# EAGLE design servotester (EAGLE 7.5.0)
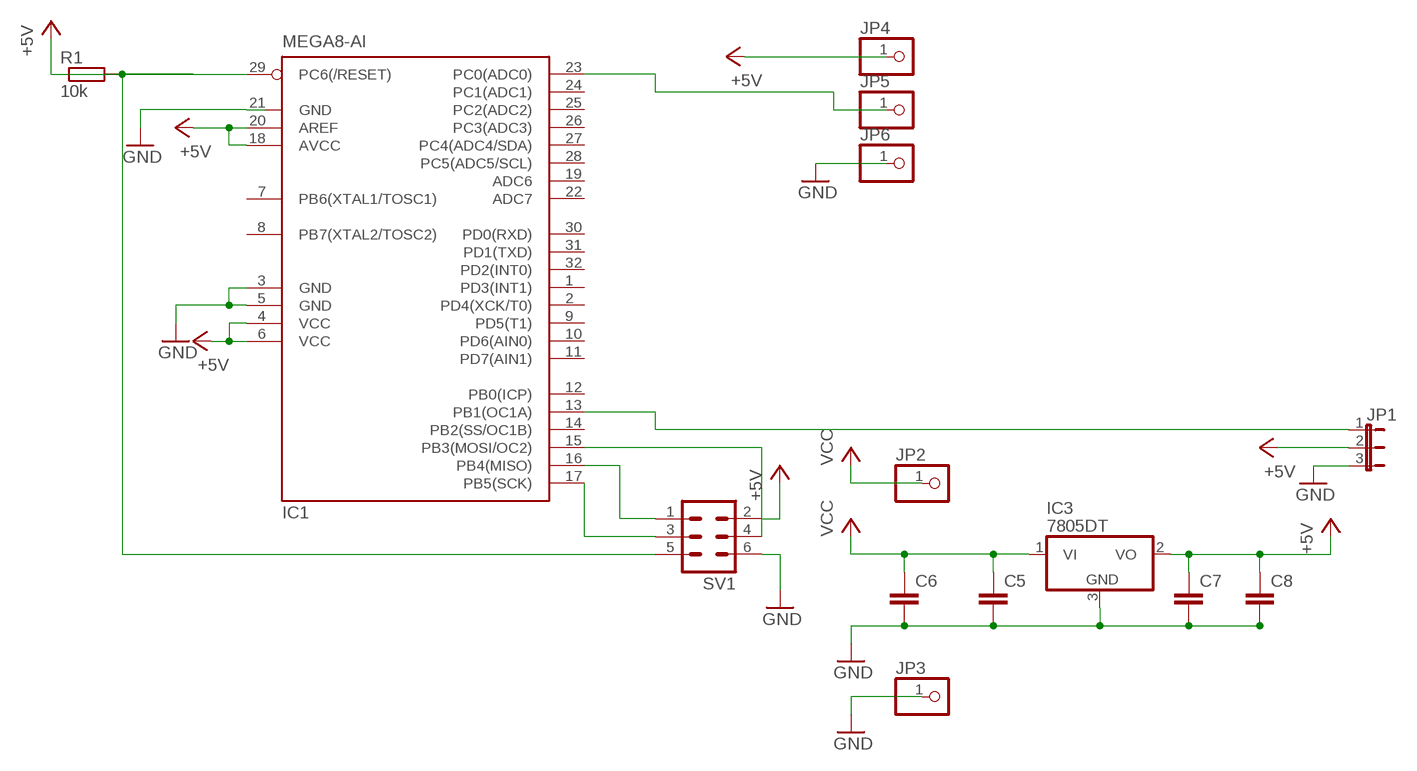
[diagram p0: schematic, sheet 1]

## Parts
C5  C-EUC1608  [C1608]
C6  C-EUC3216  [C3216]
C7  C-EUC1608  [C1608]
C8  C-EUC3216  [C3216]
IC1  MEGA8-AI  [TQFP32-08]
IC3  7805DT  [TO252]
JP1  JP2E  [JP2]
JP2  PINHD-1X1  [1X01]
JP3  PINHD-1X1  [1X01]
JP4  PINHD-1X1  [1X01]
JP5  PINHD-1X1  [1X01]
JP6  PINHD-1X1  [1X01]
R1  10k  R-EU_R0603  [R0603]
SV1  MA03-2  [MA03-2]

## Nets
+5V: C7.1 C8.1 IC1.4(VCC) IC1.6(VCC) IC1.18(AVCC) IC1.20(AREF) IC3.2(VO) JP1.2 JP4.1 R1.1 SV1.2
GND: C5.2 C6.2 C7.2 C8.2 IC1.3(GND) IC1.5(GND) IC1.21(GND) IC3.3(GND) JP1.3 JP3.1 JP6.1 SV1.6
N$1: IC1.29(PC6(/RESET)) R1.2 SV1.5
N$2: IC1.23(PC0(ADC0)) JP5.1
N$4: IC1.13(PB1(OC1A)) JP1.1
N$5: IC1.16(PB4(MISO)) SV1.1
N$6: IC1.17(PB5(SCK)) SV1.3
N$7: IC1.15(PB3(MOSI/OC2)) SV1.4
VCC: C5.1 C6.1 IC3.1(VI) JP2.1
Unconnected: IC1.1(PD3(INT1)) IC1.2(PD4(XCK/T0)) IC1.7(PB6(XTAL1/TOSC1)) IC1.8(PB7(XTAL2/TOSC2)) IC1.9(PD5(T1)) IC1.10(PD6(AIN0)) IC1.11(PD7(AIN1)) IC1.12(PB0(ICP)) IC1.14(PB2(SS/OC1B)) IC1.19(ADC6) IC1.22(ADC7) IC1.24(PC1(ADC1)) IC1.25(PC2(ADC2)) IC1.26(PC3(ADC3)) IC1.27(PC4(ADC4/SDA)) IC1.28(PC5(ADC5/SCL)) IC1.30(PD0(RXD)) IC1.31(PD1(TXD)) IC1.32(PD2(INT0))

## Library data of the parts
C5-C8 = resistor:C-EU: CAPACITOR, European symbol
IC1 = atmel:MEGA8: MICROCONTROLLER 8 Kbytes FLASH, 1 kbytes SRAM, 512 bytes EEPROM, USART, 6-channel 10 bit ADC, 2-channel 8 bit ADC Pin compatible with Atmega48, ATMega88, ATMega168 Source: avr.lbr; MPN: ATMEGA8-16AU; OC_FARNELL: 9171371; OC_NEWARK: 73M8863
IC3 = linear:78*: Positive VOLTAGE REGULATOR Source: http://cache.national.com/ds/LM/LM78L05.pdf http://www.fairchildsemi.com/ds/LM/LM7805.pdf
JP1 = jumper:JP2E: JUMPER
JP2-JP6 = pinhead:PINHD-1X1: PIN HEADER
R1 = resistor:R-EU_: RESISTOR, European symbol
SV1 = con-lstb:MA03-2: PIN HEADER; OC_FARNELL: unknown; OC_NEWARK: unknown

## Board
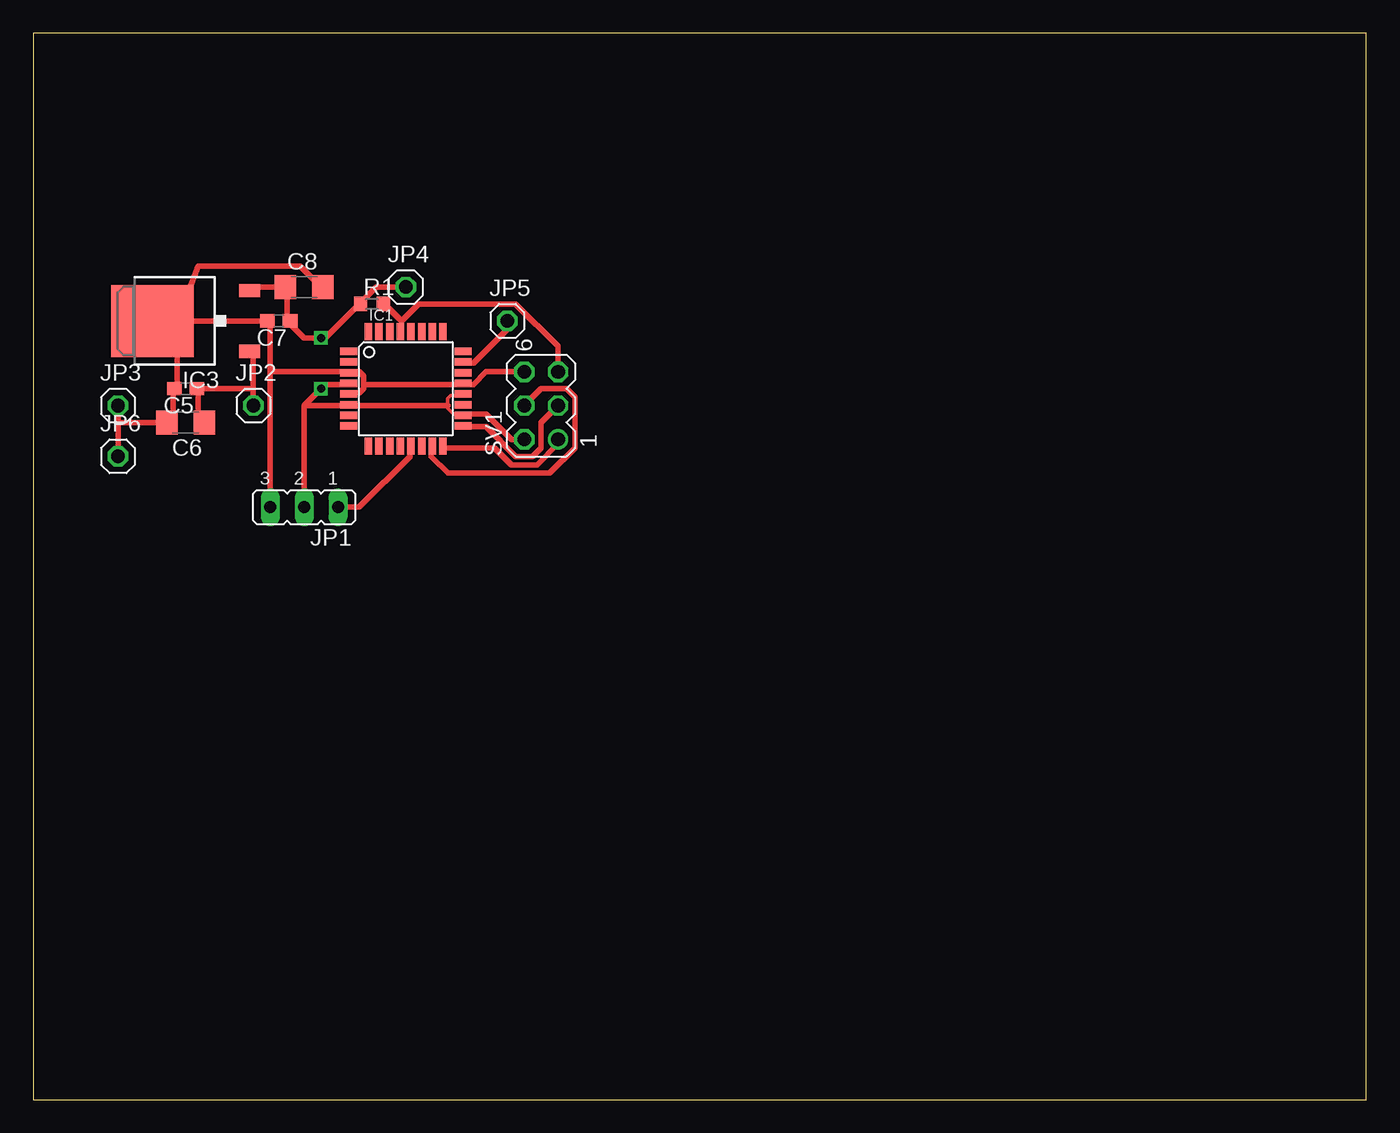
[diagram p1: board, top side]
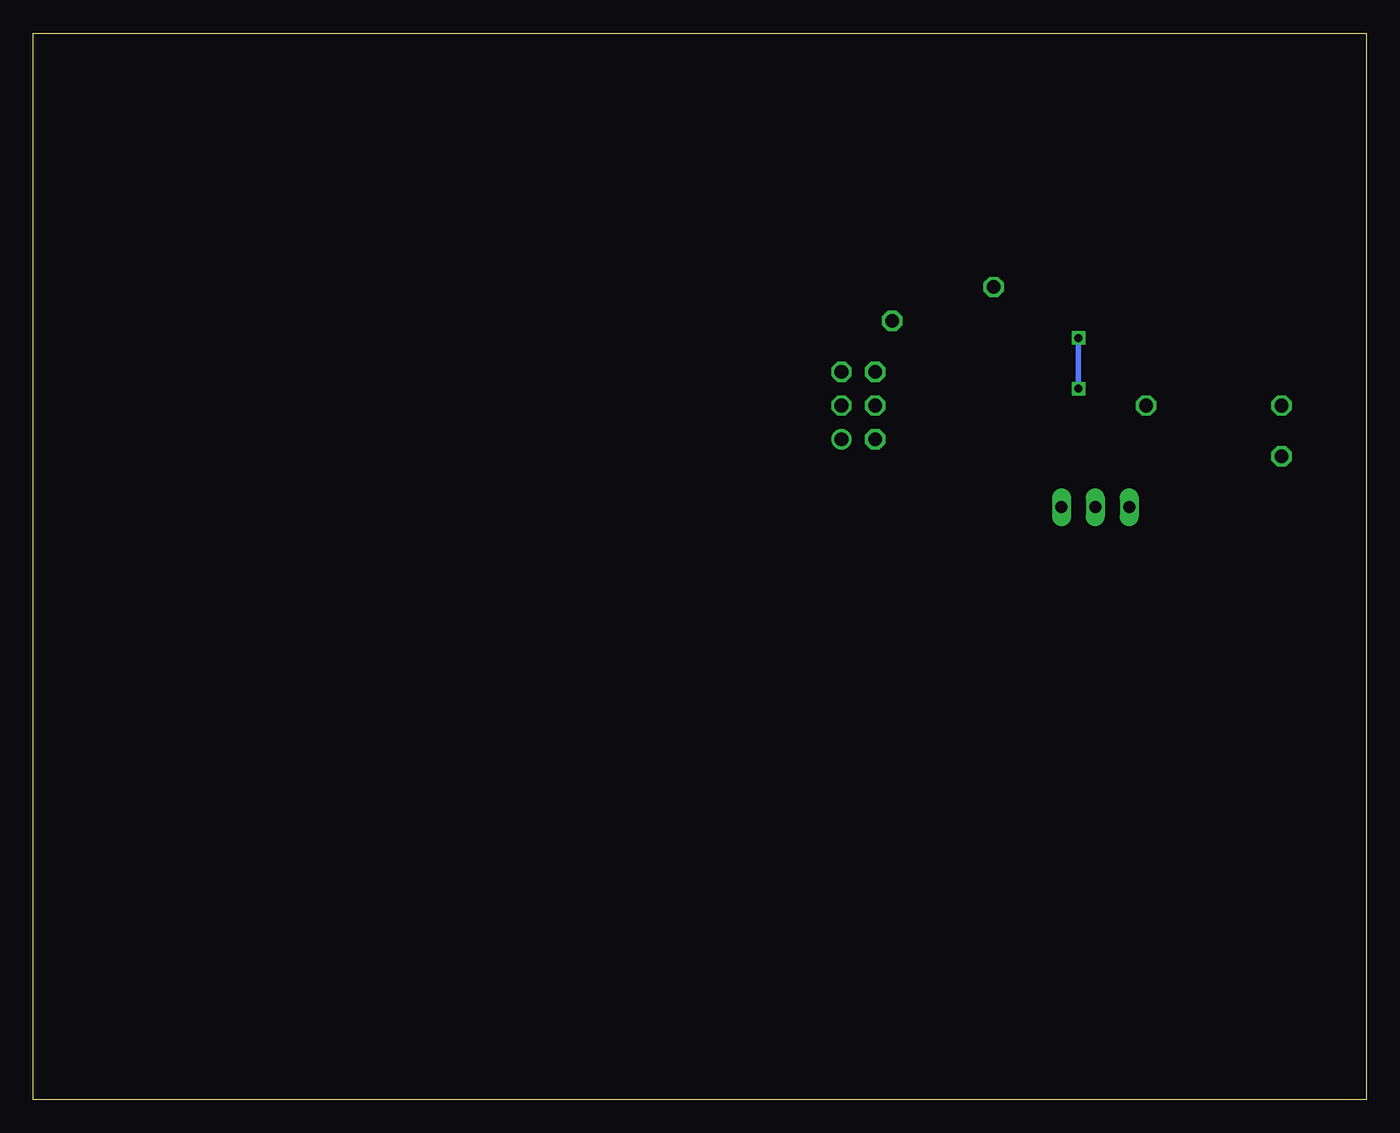
[diagram p2: board, bottom side, seen from below]

Size 100 x 80 mm. Coordinates in mm from the lower left corner, seen from the top.
Outline: 0,0 100,0 100,80 0,80 0,0
Copper layers (1*16): Top 0.035mm / dielectric 1.5mm / Bottom 0.035mm
Design rules "default *": minimum track width 0.4mm, minimum drill 1mm, track to track 0.2mm, track to pad 0.2mm, pad to pad 1mm, via to via 1mm, smd to smd 8mil, copper to edge 40mil, drill to drill 8mil, minimum pad ring 10mil, minimum via ring 8mil, stop-mask expansion 4mil, vias tented up to drill 0mil, thermal gap 10mil

### Footprints (pad centres in the part's own frame; a part is rotated, then mirrored left to right if it is on the bottom)
C1608 = smd 1.1 x 1: 1 -0.85,0; 2 0.85,0
C3216 = smd 1.6 x 1.8: 1 -1.4,0; 2 1.4,0
TQFP32-08 = smd 1.27 x 0.559: 1 -4.293,2.8; 2 -4.293,2; 3 -4.293,1.2; 4 -4.293,0.4; 5 -4.293,-0.4; 6 -4.293,-1.2; 7 -4.293,-2; 8 -4.293,-2.8; 17 4.293,-2.8; 18 4.293,-2; 19 4.293,-1.2; 20 4.293,-0.4; 21 4.293,0.4; 22 4.293,1.2; 23 4.293,2; 24 4.293,2.8 | smd 0.559 x 1.27: 9 -2.8,-4.293; 10 -2,-4.293; 11 -1.2,-4.293; 12 -0.4,-4.293; 13 0.4,-4.293; 14 1.2,-4.293; 15 2,-4.293; 16 2.8,-4.293; 25 2.8,4.293; 26 2,4.293; 27 1.2,4.293; 28 0.4,4.293; 29 -0.4,4.293; 30 -1.2,4.293; 31 -2,4.293; 32 -2.8,4.293
TO252 = smd 1 x 1.6: 1 -2.28,-4.8; 2 2.28,-4.8 | smd 5.4 x 6.2: 3 0,2.5
JP2 = drill 0.914 long: 1 -2.54,0; 2 0,0; 3 2.54,0
1X01 = drill 1.016 octagon: 1 0,0
R0603 = smd 1 x 1.1: 1 -0.85,0; 2 0.85,0
MA03-2 = drill 1.016: 1 -2.54,-1.27 | drill 1.016 octagon: 2 -2.54,1.27; 3 0,-1.27; 4 0,1.27; 5 2.54,-1.27; 6 2.54,1.27

### Placement (x,y rotation side)
C5  11.43,53.34 180 top
C6  11.43,50.8 180 top
C7  18.41,58.42 180 top
C8  20.32,60.96 0 top
IC1  27.94,53.34 0 top
IC3  11.43,58.42 90 top
JP1  20.32,44.45 180 top
JP2  16.51,52.07 0 top
JP3  6.35,52.07 0 top
JP4  27.94,60.96 0 top
JP5  35.56,58.42 0 top
JP6  6.35,48.26 0 top
R1  25.4,59.69 0 top
SV1  38.1,52.07 90 top

### Tracks (layer width: path | path; a pad name or v marks a point on that pad's centre or on a via)
+5V  (via drill 0.6)
  Top 0.254: 16.19,60.96 IC3.2 | IC1.18 32.23,51.44 31.55,51.44 31.09,51.89 31.09,52.07 31.09,52.58 31.32,52.81 32.23,52.81 IC1.20 | 23.77,52.12 IC1.6
  Top 0.4: C7.1 19.05,58.42 19.05,60.96 C8.1 16.51,60.96 IC3.2 | 24.45,59.69 21.91,57.15 v21.59,57.15 | 20.32,52.07 23.5,52.07 IC1.6 23.81,52.07 31.09,52.07 31.11,52.07 | v21.59,53.34 21.91,53.66 23.5,53.66 IC1.4 | SV1.2 35.88,49.53 33.97,51.44 32.38,51.44 IC1.18 | JP4.1 25.72,60.96 24.45,59.69 | 24.45,59.69 R1.1
  Top 0.406: JP1.2 20.32,52.07 v21.59,53.34 | v21.59,57.15 20.32,57.15 19.05,58.42
  Bottom 0.406: v21.59,53.34 v21.59,57.15
GND
  Top 0.254: 24.46,53.03 24.45,53.03 23.77,53.03 IC1.5 | 24.46,54.41 23.77,54.41 IC1.3
  Top 0.4: 24.77,53.66 24.77,54.29 24.45,54.61 23.81,54.61 IC1.3 23.5,54.61 17.78,54.61 | 24.77,53.66 24.77,53.34 24.45,53.02 24.45,53.03 | 24.77,53.66 32.07,53.66 IC1.21 32.38,53.66 33.02,53.66 33.97,54.61 SV1.6 | JP3.1 6.35,50.8 | 6.35,50.8 JP6.1 | 10.79,58.42 C7.2 17.78,58.42 17.78,54.61 | 10.79,58.42 12.38,62.55 20,62.55 21.59,60.96 C8.2 | 10.79,58.42 10.79,53.34 C5.2 10.48,53.34 10.48,51.12 10.16,50.8 C6.2 6.35,50.8 | 10.79,58.42 IC3.3 | 17.78,54.61 JP1.3
N$1
  Top 0.4: 27.62,58.42 26.35,59.69 R1.2 | 27.62,58.42 27.62,57.78 IC1.29 | 27.62,58.42 28.89,59.69 36.2,59.69 39.37,56.52 SV1.5
N$2
  Top 0.4: JP5.1 35.56,57.78 33.02,55.24 32.38,55.24 IC1.23
N$4
  Top 0.4: JP1.1 24.45,44.45 28.26,48.26 28.26,48.9 IC1.13
N$5
  Top 0.4: SV1.1 39.37,49.21 37.78,47.62 35.88,47.62 34.61,48.9 30.8,48.9 IC1.16
N$6
  Top 0.254: 32.23,50.52 IC1.17
  Top 0.4: SV1.3 38.1,50.8 38.1,48.9 37.47,48.26 36.2,48.26 33.97,50.48 32.38,50.48 IC1.17
N$7
  Top 0.4: SV1.4 38.1,53.34 40.01,53.34 40.64,52.7 40.64,48.9 38.73,46.99 31.11,46.99 29.84,48.26 29.84,48.9 IC1.15
VCC
  Top 0.4: 12.38,53.34 12.38,51.12 12.7,50.8 C6.1 | JP2.1 16.51,53.34 | 16.51,53.34 16.51,55.88 IC3.1 | 16.51,53.34 12.38,53.34 | 12.38,53.34 C5.1